# EAGLE design blue_lora_v2 (EAGLE 9.1.3)
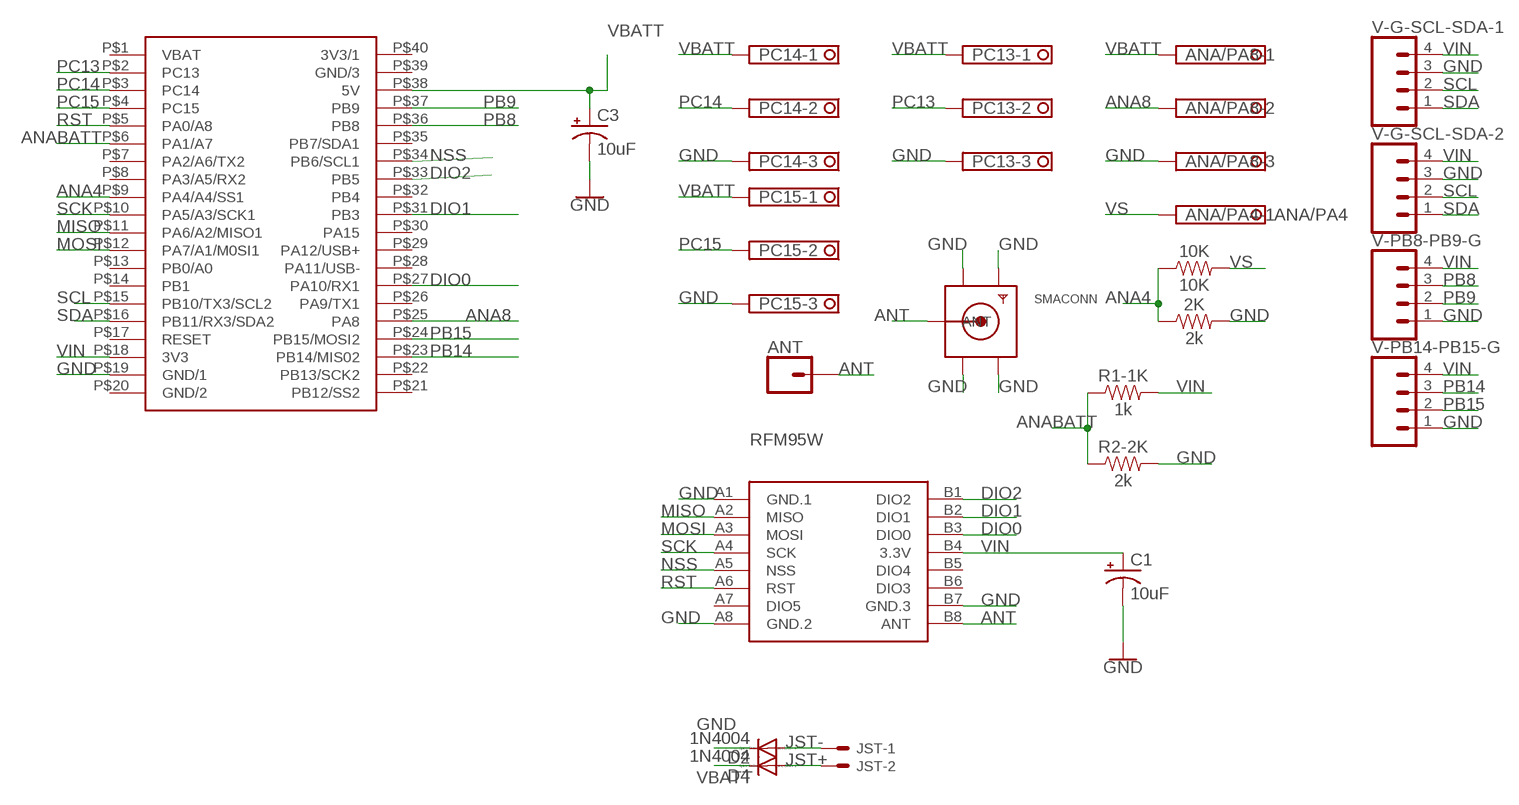
[diagram p0: schematic, sheet 1]

## Parts
2K  2k  1KOHM-HORIZ_KIT-1/4W-1%  [AXIAL-0.3-KIT]
10K  10K  1KOHM-HORIZ_KIT-1/4W-1%  [AXIAL-0.3-KIT]
ANA/PA4  ANA/PA4  TERMINAL-BLOCK-3.5MM-2-PIN-LONG-PAD  [TERMINAL-BLOCK-2-PIN-3.5MM-LONG-PAD]
ANA/PA8  TERMINAL-BLOCK-3.5MM-3-PIN-LONG-PAD  [TERMINAL-BLOCK-3-PIN-3.5MM-LONG-PAD]
ANT  CONN_01  [1X01]
C1  10uF  10UF-POLAR-RADIAL-2.5MM-25V-20%  [CPOL-RADIAL-2.5MM-5MM]
C3  10uF  10UF-POLAR-RADIAL-2.5MM-25V-20%  [CPOL-RADIAL-2.5MM-5MM]
D2  1N4004  [DO41-10]
D4  1N4004  [DO41-10]
JST  JST-XH-02-PIN-LONG-PAD  [JST-XH-02-PACKAGE-LONG-PAD]
PC13  TERMINAL-BLOCK-3.5MM-3-PIN-LONG-PAD  [TERMINAL-BLOCK-3-PIN-3.5MM-LONG-PAD]
PC14  TERMINAL-BLOCK-3.5MM-3-PIN-LONG-PAD  [TERMINAL-BLOCK-3-PIN-3.5MM-LONG-PAD]
PC15  TERMINAL-BLOCK-3.5MM-3-PIN-LONG-PAD  [TERMINAL-BLOCK-3-PIN-3.5MM-LONG-PAD]
R1-1K  1k  1KOHM-HORIZ_KIT-1/4W-1%  [AXIAL-0.3-KIT]
R2-2K  2k  1KOHM-HORIZ_KIT-1/4W-1%  [AXIAL-0.3-KIT]
RFM95W  WIRELESS-LORA-RFM95W#SMD  [WIRELESS-LORA-RFM95W#SMD]
SMACONN  SMACONNECTOR_EDGE  [SMA_EDGELAUNCH]
U$2  BLUEPILL  [BLUEPILL]
V-G-SCL-SDA-1  CONN_04LOCK_LONGPADS  [1X04_LOCK_LONGPADS]
V-G-SCL-SDA-2  CONN_04LOCK_LONGPADS  [1X04_LOCK_LONGPADS]
V-PB8-PB9-G  CONN_04LOCK_LONGPADS  [1X04_LOCK_LONGPADS]
V-PB14-PB15-G  CONN_04LOCK_LONGPADS  [1X04_LOCK_LONGPADS]

## Nets
ANA4: 2K.P$1 10K.P$1 U$2.P$9(PA4/A4/SS1)
ANA8: ANA/PA8.2 U$2.P$25(PA8)
ANABATT: R1-1K.P$1 R2-2K.P$1 U$2.P$6(PA1/A7)
ANT: ANT.1 RFM95W.B8(ANT) SMACONN.P(ANT)
DIO0: RFM95W.B3(DIO0) U$2.P$27(PA10/RX1)
DIO1: RFM95W.B2(DIO1) U$2.P$31(PB3)
DIO2: RFM95W.B1(DIO2) U$2.P$33(PB5)
GND: 2K.P$2 ANA/PA8.3 C1.2(-) C3.2(-) D2.C PC13.3 PC14.3 PC15.3 R2-2K.P$2 RFM95W.A1(GND.1) RFM95W.A8(GND.2) RFM95W.B7(GND.3) SMACONN.GND@1(GND4) SMACONN.GND@2(GND3) SMACONN.GND@3(GND2) SMACONN.GND@4(GND1) U$2.P$19(GND/1) V-G-SCL-SDA-1.3 V-G-SCL-SDA-2.3 V-PB8-PB9-G.1 V-PB14-PB15-G.1
JST+: D4.A JST.2
JST-: D2.A JST.1
MISO: RFM95W.A2(MISO) U$2.P$11(PA6/A2/MISO1)
MOSI: RFM95W.A3(MOSI) U$2.P$12(PA7/A1/M0SI1)
NSS: RFM95W.A5(NSS) U$2.P$34(PB6/SCL1)
PB8: U$2.P$36(PB8) V-PB8-PB9-G.3
PB9: U$2.P$37(PB9) V-PB8-PB9-G.2
PB14: U$2.P$23(PB14/MIS02) V-PB14-PB15-G.3
PB15: U$2.P$24(PB15/MOSI2) V-PB14-PB15-G.2
PC13: PC13.2 U$2.P$2(PC13)
PC14: PC14.2 U$2.P$3(PC14)
PC15: PC15.2 U$2.P$4(PC15)
RST: RFM95W.A6(RST) U$2.P$5(PA0/A8)
SCK: RFM95W.A4(SCK) U$2.P$10(PA5/A3/SCK1)
SCL: U$2.P$15(PB10/TX3/SCL2) V-G-SCL-SDA-1.2 V-G-SCL-SDA-2.2
SDA: U$2.P$16(PB11/RX3/SDA2) V-G-SCL-SDA-1.1 V-G-SCL-SDA-2.1
VBATT: ANA/PA8.1 C3.1(+) D4.C PC13.1 PC14.1 PC15.1 U$2.P$38(5V)
VIN: C1.1(+) R1-1K.P$2 RFM95W.B4(3.3V) U$2.P$18(3V3) V-G-SCL-SDA-1.4 V-G-SCL-SDA-2.4 V-PB8-PB9-G.4 V-PB14-PB15-G.4
VS: 10K.P$2 ANA/PA4.1
Unconnected: ANA/PA4.2 RFM95W.A7(DIO5) RFM95W.B5(DIO4) RFM95W.B6(DIO3) U$2.P$1(VBAT) U$2.P$7(PA2/A6/TX2) U$2.P$8(PA3/A5/RX2) U$2.P$13(PB0/A0) U$2.P$14(PB1) U$2.P$17(RESET) U$2.P$20(GND/2) U$2.P$21(PB12/SS2) U$2.P$22(PB13/SCK2) U$2.P$26(PA9/TX1) U$2.P$28(PA11/USB-) U$2.P$29(PA12/USB+) U$2.P$30(PA15) U$2.P$32(PB4) U$2.P$35(PB7/SDA1) U$2.P$39(GND/3) U$2.P$40(3V3/1)

## Library data of the parts
2K 10K R2-2K = SparkFun-Resistors:1KOHM: 1kΩ resistor A resistor is a passive two-terminal electrical component that implements electrical resistance as a circuit element. Resistors act to reduce current flow, and, at the same time, act to lower voltage levels within circuits. - Wikipedia; PROD_ID: RES-12182; VALUE: 1k
ANA/PA4 = Rembrandt Electronics - Terminal Block 3-5mm v1-0:TERMINAL-BLOCK-3.5MM-2-PIN: Terminal Block 3.5mm Pitch: 3,5 mm Number of pins: 2 Created by Rembrandt Electronics www.rembrandtelectronics.com
ANA/PA8 PC13-PC15 = Rembrandt Electronics - Terminal Block 3-5mm v1-0:TERMINAL-BLOCK-3.5MM-3-PIN: Terminal Block 3.5mm Pitch: 3,5 mm Number of pins: 3 Created by Rembrandt Electronics www.rembrandtelectronics.com
ANT = SparkFun-Connectors:CONN_01: Single connection point. Often used as Generic Header-pin footprint for 0.1 inch spaced/style header connections On any of the 0.1 inch spaced packages, you can populate with these: Break Away Headers - Straight <https://www.sparkfun.com/products/116> (PRT-00116) Break Away Male Headers - Right Angle <https://www.sparkfun.com/products/553> (PRT-00553) Female Headers <https://www.sparkfun.com/products/115> (PRT-00115) Break Away Headers - Machine Pin <https://www.sparkfun.com/products/117> (PRT-00117) Break Away Female Headers - Swiss Machine Pin <https://www.sparkfun.com/products/743> (PRT-00743) This device is also useful as a general connection point to wire up your design to another part of your project. Our various solder wires solder well into these plated through hole pads. Hook-Up Wire - Assortment (Stranded, 22 AWG) <https://www.sparkfun.com/products/11375> (PRT-11375) Hook-Up Wire - Assortment (Solid Core, 22 AWG) <https://www.sparkfun.com/products/11367> (PRT-11367) View the entire wire category on our website here <https://www.sparkfun.com/categories/141> Special notes: SMTSO-256-ET is a "flush mount" nut for a 4-40 screw. We mostly use this on specialty testbeds; it is a nice way to connect hardware to your PCB at an adjustable hieght. Also note, the SNAP packages are for using a snappable style connector. We sell a baggie of snaps and they are also used on two LilyPad designs: Snap Assortment - 30 pack (male and female) <https://www.sparkfun.com/products/11347> (DEV-11347) LilyPad Arduino SimpleSnap <https://www.sparkfun.com/products/10941> (DEV-10941) LilyPad SimpleSnap Protoboard <https://www.sparkfun.com/products/10940> (DEV-10940)
C1 C3 = SparkFun-Capacitors:10UF-POLAR: 10.0µF polarized capacitors A capacitor is a passive two-terminal electrical component used to store electrical energy temporarily in an electric field.; PROD_ID: CAP-08440
D2 D4 = diode:1N4004: DIODE general purpose rectifier, 1 A
JST = Rembrandt Electronics - JST XH Connectors v1-0:JST-XH-02-PIN: JST XH Connector 2 Pin Wire to board connector. Pitch: 2,54 mm, (0.100") Number of pins: 2 Created by Rembrandt Electronics www.rembrandtelectronics.com
R1-1K = SparkFun-Resistors:1KOHM: 1kΩ resistor A resistor is a passive two-terminal electrical component that implements electrical resistance as a circuit element. Resistors act to reduce current flow, and, at the same time, act to lower voltage levels within circuits. - Wikipedia; PROD_ID: RES-12182
RFM95W = diy-modules:WIRELESS-LORA-RFM95W: 868/915 MHz LoRa Radio Transceiver Module based on SX1276 chip Click here to find device on ebay.com <http://www.ebay.com/sch/RFM95W+transceiver>
SMACONN = adafruit:SMACONNECTOR: SMA Connector 90° DIP SMA Connector, 50 Ohm (4UConnector: 07259)
U$2 = stm32duino boards:BLUEPILL
V-G-SCL-SDA-1 V-G-SCL-SDA-2 V-PB8-PB9-G V-PB14-PB15-G = SparkFun-Connectors:CONN_04: Multi connection point. Often used as Generic Header-pin footprint for 0.1 inch spaced/style header connections On any of the 0.1 inch spaced packages, you can populate with these: Break Away Headers - Straight <https://www.sparkfun.com/products/116> (PRT-00116) Break Away Male Headers - Right Angle <https://www.sparkfun.com/products/553> (PRT-00553) Female Headers <https://www.sparkfun.com/products/115> (PRT-00115) Break Away Headers - Machine Pin <https://www.sparkfun.com/products/117> (PRT-00117) Break Away Female Headers - Swiss Machine Pin <https://www.sparkfun.com/products/743> (PRT-00743) For SCREWTERMINALS and SPRING TERMINALS visit here: Screw Terimnals on SparkFun.com <https://www.sparkfun.com/search/results?term=Screw+Terminals> (5mm/3.5mm/2.54mm spacing) This device is also useful as a general connection point to wire up your design to another part of your project. Our various solder wires solder well into these plated through hole pads. Hook-Up Wire - Assortment (Stranded, 22 AWG) <https://www.sparkfun.com/products/11375> (PRT-11375) Hook-Up Wire - Assortment (Solid Core, 22 AWG) <https://www.sparkfun.com/products/11367> (PRT-11367) View the entire wire category on our website here <https://www.sparkfun.com/categories/141> Special notes: Molex polarized connector foot print use with SKU : PRT-08231 with associated crimp pins and housings. 1MM SMD Version SKU: PRT-10208; PROD_ID: CONN-09696

## Board
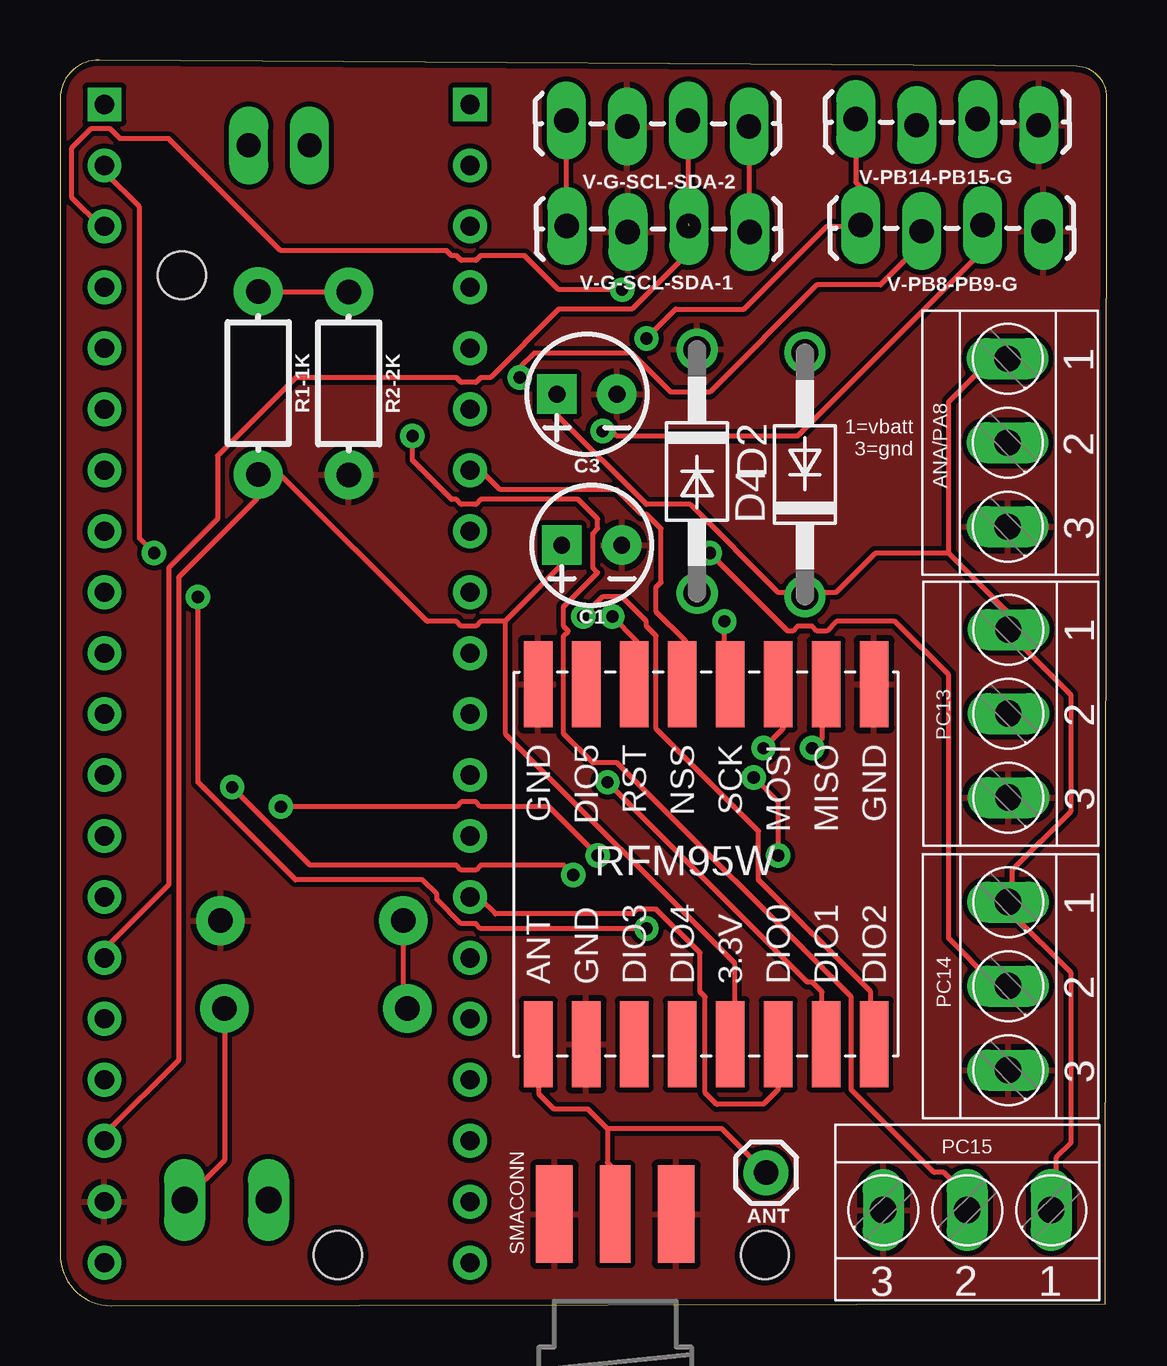
[diagram p1: board, top side]
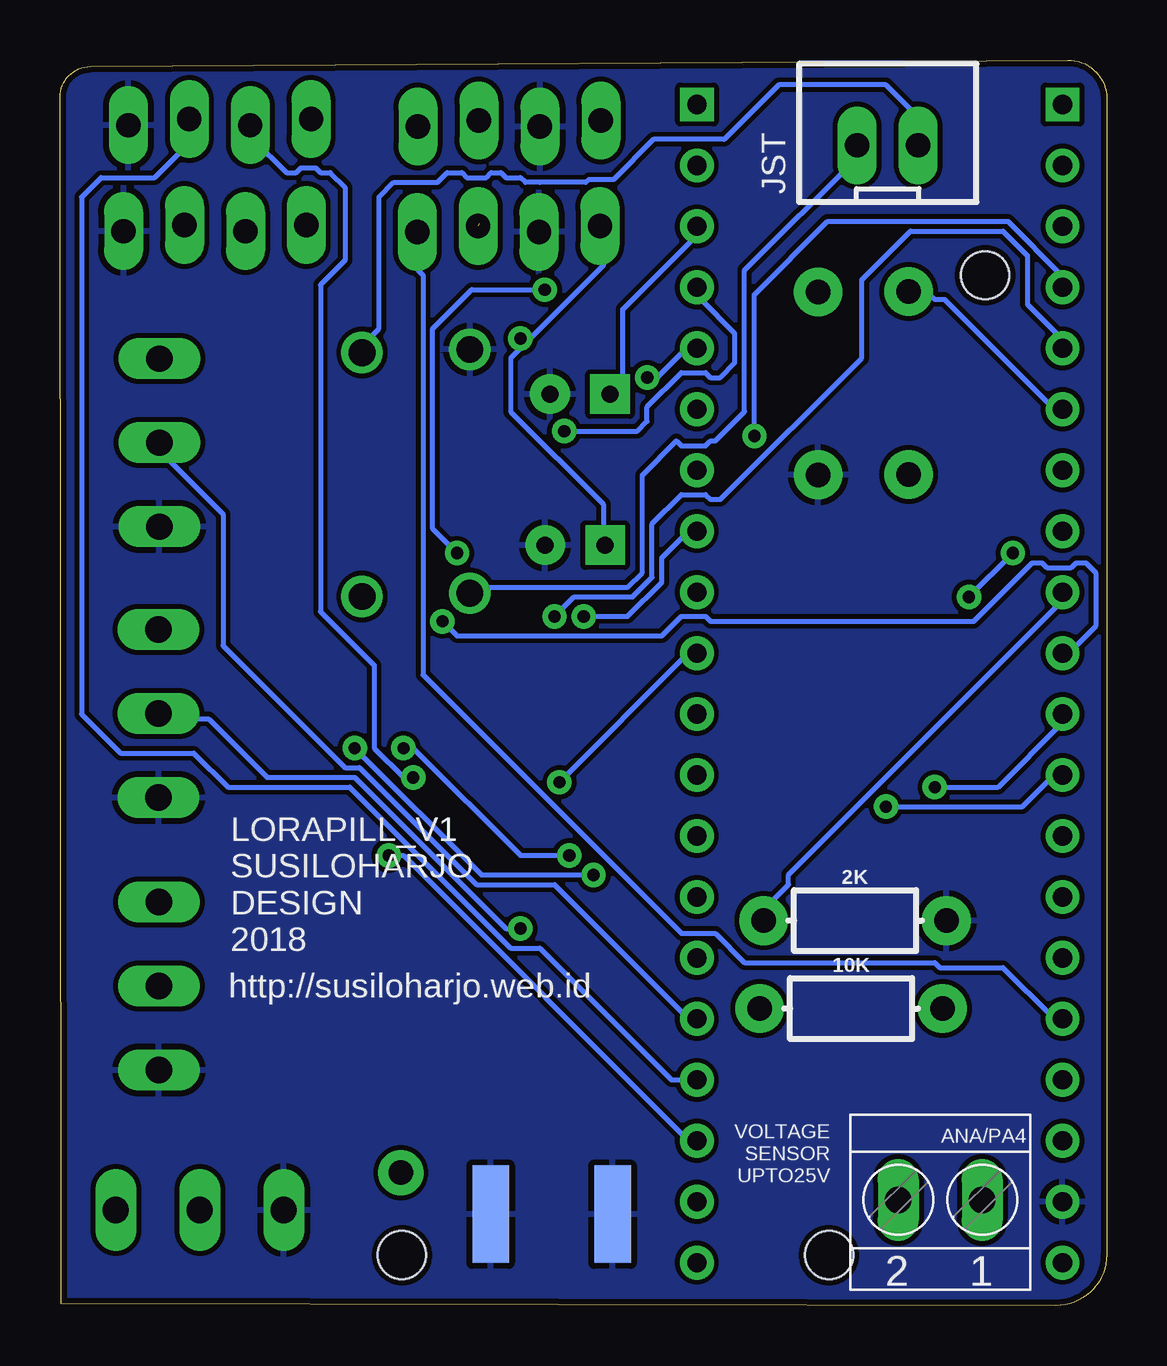
[diagram p2: board, bottom side, seen from below]

Size 43.64 x 51.9 mm. Coordinates in mm from the lower left corner, seen from the top.
Outline: 0,50.28 0.01,2.12 arc90 2.13,0 43.58,0.08 43.64,50.34 arc90 42.37,51.63 1.64,51.9 arc90 0,50.28
Copper layers (1*16): Top 0.035mm / dielectric 1.5mm / Bottom 0.035mm
Design rules "SparkFun": minimum track width 8mil, minimum drill 20mil, track to track 8mil, track to pad 8mil, pad to pad 8mil, via to via 8mil, smd to smd 8mil, copper to edge 10mil, drill to drill 8mil, minimum pad ring 12mil, minimum via ring 10mil, stop-mask expansion 4mil, vias tented up to drill 25mil, thermal gap 10mil
Holes 2 mm at 5.08,42.93 11.58,2.1 29.38,2.1

### Footprints (pad centres in the part's own frame; a part is rotated, then mirrored left to right if it is on the bottom)
AXIAL-0.3-KIT = drill 1.016 pad 2.032: P$1 -3.81,0; P$2 3.81,0
TERMINAL-BLOCK-2-PIN-3.5MM-LONG-PAD = drill 1.1 pad 1.7 long: 1 -1.75,-0.1; 2 1.75,-0.1
TERMINAL-BLOCK-3-PIN-3.5MM-LONG-PAD = drill 1.1 pad 1.7 long: 1 -3.5,-0.1; 2 0,-0.1; 3 3.5,-0.1
1X01 = drill 1.016 pad 1.88: 1 0,0
CPOL-RADIAL-2.5MM-5MM = drill 0.7 pad 1.651 square: 1 1.25,0 | drill 0.7 pad 1.651: 2 -1.25,0
DO41-10 = drill 1.118: A 5.08,0; C -5.08,0
JST-XH-02-PACKAGE-LONG-PAD = drill 1.016 long: 1 -1.27,0; 2 1.27,0
WIRELESS-LORA-RFM95W#SMD = smd 3.6 x 1.2: A1 -7.5,7; A2 -7.5,5; A3 -7.5,3; A4 -7.5,1; A5 -7.5,-1; A6 -7.5,-3; A7 -7.5,-5; A8 -7.5,-7; B1 7.5,7; B2 7.5,5; B3 7.5,3; B4 7.5,1; B5 7.5,-1; B6 7.5,-3; B7 7.5,-5; B8 7.5,-7
SMA_EDGELAUNCH = smd 4.064 x 1.524: GND@1 2.032,-2.54; GND@2 2.032,2.54 | smd 4.064 x 1.524 bottom: GND@3 2.032,2.54; GND@4 2.032,-2.54 | smd 4.064 x 1.27: P 2.032,0
BLUEPILL = drill 0.8 square: P$1 -7.62,22.86; P$40 7.62,22.86 | drill 0.8: P$2 -7.62,20.32; P$3 -7.62,17.78; P$4 -7.62,15.24; P$5 -7.62,12.7; P$6 -7.62,10.16; P$7 -7.62,7.62; P$8 -7.62,5.08; P$9 -7.62,2.54; P$10 -7.62,0; P$11 -7.62,-2.54; P$12 -7.62,-5.08; P$13 -7.62,-7.62; P$14 -7.62,-10.16; P$15 -7.62,-12.7; P$16 -7.62,-15.24; P$17 -7.62,-17.78; P$18 -7.62,-20.32; P$19 -7.62,-22.86; P$20 -7.62,-25.4; P$21 7.62,-25.4; P$22 7.62,-22.86; P$23 7.62,-20.32; P$24 7.62,-17.78; P$25 7.62,-15.24; P$26 7.62,-12.7; P$27 7.62,-10.16; P$28 7.62,-7.62; P$29 7.62,-5.08; P$30 7.62,-2.54; P$31 7.62,0; P$32 7.62,2.54; P$33 7.62,5.08; P$34 7.62,7.62; P$35 7.62,10.16; P$36 7.62,12.7; P$37 7.62,15.24; P$38 7.62,17.78; P$39 7.62,20.32
1X04_LOCK_LONGPADS = drill 1.016 long: 1 0,0; 2 2.54,-0.254; 3 5.08,0; 4 7.62,-0.254

### Placement (x,y rotation side)
2K  10.5,16.04 0 bottom
10K  10.66,12.37 0 bottom
ANA/PA4  6.95,4.3 180 bottom
ANA/PA8  39.6,35.95 270 top
ANT  29.43,5.54 0 top
C1  22.17,31.69 180 top
C3  21.97,37.97 180 top
D2  26.56,34.76 270 top
D4  31.05,34.63 90 top
JST  9.14,48.34 0 bottom
PC13  39.63,24.67 270 top
PC14  39.62,13.31 270 top
PC15  37.82,3.88 180 top
R1-1K  8.26,38.44 270 top
R2-2K  12.04,38.42 270 top
RFM95W  26.94,18.39 270 top
SMACONN  23.15,1.78 90 top
U$2  9.47,27.19 0 top
V-G-SCL-SDA-1  28.75,44.73 180 top
V-G-SCL-SDA-2  28.72,49.12 180 top
V-PB8-PB9-G  40.99,44.77 180 top
V-PB14-PB15-G  40.79,49.18 180 top

### Tracks (layer width: path | path; a pad name or v marks a point on that pad's centre or on a via)
ANA4
  Top 0.203: 2K.P$1 14.31,12.54 10K.P$1
  Bottom 0.203: U$2.P$9 1.89,29.53 1.89,29.32 13.27,17.94 13.27,17.54 14.29,16.52 14.29,16.11 2K.P$1
ANA8
  Bottom 0.203: U$2.P$25 17.13,12.05 17.54,12.05 23.03,17.54 26.28,17.54 31.15,22.41 31.76,22.41 36.84,27.49 36.84,32.98 39.69,35.82 ANA/PA8.2
ANABATT
  Top 0.203: R1-1K.P$1 12.02,42.25 R2-2K.P$1
  Bottom 0.203: U$2.P$6 1.89,37.45 2.3,37.45 6.77,41.92 7.18,41.92 7.38,42.12 8.19,42.12 R1-1K.P$1
ANT
  Top 0.203: 22.82,7.38 22.01,8.19 20.59,8.19 19.98,8.8 19.98,10.83 RFM95W.B8 | SMACONN.P 23.03,3.92 23.03,5.75 22.82,5.95 22.82,7.38 | ANT.1 27.59,7.38 22.82,7.38
DIO0
  Top 0.203: U$2.P$27 17.13,16.93 17.54,16.93 18.15,16.32 23.84,16.32 24.04,16.52 24.85,16.52 26.68,14.69 26.68,13.07 26.89,12.86 26.89,8.87 27.39,8.37 27.41,8.39 29.32,8.39 29.93,9 29.93,10.83 RFM95W.B3
DIO1  (via drill 0.51)
  Top 0.203: v22.82,21.8 31.15,13.47 31.36,13.47 31.76,13.07 31.76,11.03 RFM95W.B2
  Bottom 0.203: v22.82,21.8 17.54,27.09 17.13,27.09 U$2.P$31
DIO2  (via drill 0.51)
  Top 0.203: v21.81,28.71 22.62,29.53 23.43,29.53 24.45,28.51 24.45,28.31 24.85,27.9 24.85,24.04 29.12,19.77 29.12,17.74 33.79,13.07 33.79,11.03 RFM95W.B1
  Bottom 0.203: v21.81,28.71 19.98,28.71 18.55,30.13 18.55,31.15 17.54,32.17 17.13,32.17 U$2.P$33
GND
  pour Top: 1.39,51.87 arc90 1.41,51.86 42.7,51.86 arc-90 43.62,50.94 43.62,0.07 arc-90 43.52,-0.02 2.03,-0.02 arc-90 0,2 0,2.87 arc-90 -0.04,2.92 -0.04,50.48 arc-90 1.36,51.88 1.4,51.88
  pour Bottom: 42.46,51.71 arc-90 43.62,50.55 43.62,49.06 arc90 43.47,48.91 43.47,0.03 arc90 43.46,0.04 2.12,0.04 arc-90 -0.03,2.19 -0.03,2.25 arc90 0.02,2.29 0.02,50.34 arc-90 1.39,51.72
JST+
  Bottom 0.203: JST.2 7.99,48.42 7.99,49.64 9.21,50.86 13.68,50.86 15.95,48.59 18.9,48.59 20.56,46.92 21.6,46.92 21.72,46.8 23.63,46.8 24.24,46.8 24.45,47 25.06,47 25.26,47.2 25.67,47.2 25.87,47 26.68,47 26.89,47.2 27.5,47.2 27.9,46.8 29.73,46.8 30.34,46.19 30.34,40.7 31.15,39.89 D4.A
JST-
  Bottom 0.203: JST.1 10.43,48.22 10.43,47.81 15.1,43.14 15.1,37.25 16.32,36.03 16.52,36.03 16.73,35.82 17.74,35.82 17.95,36.03 19.37,34.61 19.37,30.54 19.98,29.93 26.28,29.93 26.48,29.73 D2.A
MISO  (via drill 0.51)
  Top 0.203: v7.18,21.6 10.43,18.35 16.52,18.35 16.73,18.15 17.34,18.15 17.54,18.35 20.99,18.35 v21.4,17.94 | v31.36,23.23 31.76,23.63 31.76,25.87 RFM95W.A2
  Bottom 0.203: v7.18,21.6 4.53,21.6 1.89,24.24 1.89,24.45 U$2.P$11 | v21.4,17.94 26.07,17.94 v31.36,23.23
MOSI  (via drill 0.51)
  Top 0.203: v9.21,20.79 16.52,20.79 16.73,20.99 17.34,20.99 17.54,20.79 20.38,20.79 v22.42,18.76 | v29.32,23.23 30.14,24.04 30.14,25.87 RFM95W.A3
  Bottom 0.203: v9.21,20.79 3.52,20.79 2.3,22.01 1.89,22.01 U$2.P$12 | v22.42,18.76 24.45,18.76 28.92,23.23 v29.32,23.23
NSS
  Top 0.203: U$2.P$34 17.13,34.61 17.74,34.61 18.35,34 23.23,34 24.24,32.98 24.45,32.98 25.06,32.37 25.06,30.13 24.85,29.93 24.85,28.92 26.07,27.7 26.07,26.07 RFM95W.A5
PB8  (via drill 0.51)
  Top 0.203: v19.16,38.67 19.16,39.08 19.77,39.69 23.84,39.69 25.46,38.06 27.09,38.06 31.56,42.53 34.2,42.53 35.83,44.16 35.83,44.56 V-PB8-PB9-G.3
  Bottom 0.203: v19.16,38.67 18.76,38.67 17.74,39.69 17.13,39.69 U$2.P$36
PB9  (via drill 0.51)
  Top 0.203: v22.62,36.43 23.03,36.43 23.23,36.23 30.75,36.23 38.27,43.75 38.27,44.97 V-PB8-PB9-G.2
  Bottom 0.203: v22.62,36.43 19.57,36.43 19.16,36.84 19.16,37.45 17.74,38.87 16.73,38.87 16.52,38.67 16.12,38.67 15.51,39.28 15.51,40.5 16.93,41.92 16.93,42.33 U$2.P$37
PB14  (via drill 0.51)
  Top 0.203: v29.93,18.76 29.93,20.99 v28.92,22.01
  Bottom 0.203: v29.93,18.76 29.32,18.76 17.54,6.97 17.13,6.97 U$2.P$23 | v28.92,22.01 29.32,22.01 30.54,23.23 30.54,26.68 32.78,28.92 32.78,42.53 31.76,43.55 31.76,46.59 32.37,47.2 32.78,47.2 32.98,47.41 33.59,47.41 33.79,47.2 34.2,47.2 35.62,48.63 35.62,49.03 V-PB14-PB15-G.3
PB15
  Bottom 0.203: U$2.P$24 17.13,9.41 18.15,9.41 23.63,14.89 24.85,14.89 31.56,21.6 36.64,21.6 38.06,23.02 41.11,23.02 42.74,24.65 42.74,46.19 41.92,47 39.69,47 38.27,48.42 38.27,49.24 V-PB14-PB15-G.2
PC13  (via drill 0.51)
  Top 0.203: v3.92,31.35 3.31,31.96 3.31,45.78 1.89,47.2 1.89,47.41 U$2.P$2 | v5.75,29.53 5.75,21.8 9.82,17.74 15.1,17.74 15.71,17.13 15.71,16.93 16.73,15.91 17.34,15.91 17.54,15.71 v24.45,15.71
  Bottom 0.203: v5.75,29.53 v3.92,31.35 | v24.45,15.71 25.06,15.71 31.36,22.01 35.01,22.01 37.45,24.45 39.28,24.45 39.48,24.65 PC13.2
PC14  (via drill 0.51)
  Top 0.203: v23.43,42.33 20.79,42.33 19.37,43.75 17.54,43.75 17.34,43.55 16.73,43.55 16.52,43.75 16.32,43.75 16.12,43.95 9.21,43.95 4.53,48.63 2.5,48.63 2.1,49.03 1.28,49.03 0.47,48.22 0.47,46.19 1.69,44.97 U$2.P$3 | v27.09,31.35 30.34,28.1 30.54,28.1 30.75,28.31 31.36,28.31 31.56,28.1 31.97,28.1 32.37,28.51 34.81,28.51 37.05,26.27 37.05,15.3 38.87,13.47 39.48,13.47 PC14.2
  Bottom 0.203: v23.43,42.33 26.48,42.33 28.11,40.7 28.11,32.37 v27.09,31.35
PC15  (via drill 0.51)
  Top 0.203: v14.69,36.23 14.69,35.21 16.32,33.59 16.52,33.59 16.73,33.39 17.34,33.39 17.54,33.59 21.6,33.59 22.42,32.78 22.42,32.37 22.21,32.17 22.21,30.74 22.42,30.54 20.99,29.12 20.99,28.31 21.2,28.1 20.99,27.9 20.99,23.84 22.21,22.62 23.23,22.62 32.98,12.86 32.98,9 36.44,5.55 36.84,5.55 37.66,4.73 37.66,4.13 PC15.2
  Bottom 0.203: v14.69,36.23 14.69,42.12 11.65,45.17 4.13,45.17 1.89,42.94 1.89,42.53 U$2.P$4
RST  (via drill 0.51)
  Top 0.203: v23.03,28.71 24.04,27.7 24.04,26.07 RFM95W.A6
  Bottom 0.203: v23.03,28.71 22.21,29.53 19.77,29.53 18.96,30.34 18.96,32.57 17.74,33.79 16.73,33.79 16.52,33.59 16.12,33.59 10.22,39.48 10.22,42.73 8.19,44.77 4.33,44.77 3.31,43.75 3.31,41.72 1.89,40.29 1.89,39.89 U$2.P$5
SCK  (via drill 0.51)
  Top 0.203: v27.7,28.51 27.7,26.27 27.9,26.07 RFM95W.A4
  Bottom 0.203: v27.7,28.51 27.09,27.9 18.55,27.9 17.74,28.71 16.73,28.71 16.52,28.51 5.55,28.51 3.11,30.95 2.71,30.95 2.5,30.74 1.49,30.74 1.28,30.95 0.88,30.95 0.47,30.54 0.47,28.31 1.49,27.29 1.69,27.29 U$2.P$10
SCL  (1 unrouted)
  Top 0.203: U$2.P$15 1.89,14.49 1.89,14.89 4.53,17.54 4.53,30.74 6.57,32.78 6.57,35.42 9.82,38.67 16.52,38.67 16.73,38.47 17.34,38.47 17.54,38.67 17.95,38.67 20.79,41.51 23.84,41.51 26.07,43.75 26.07,44.97 26.18,45.07 V-G-SCL-SDA-2.2
SDA
  Top 0.203: V-G-SCL-SDA-2.1 28.72,44.77 V-G-SCL-SDA-1.1
  Bottom 0.203: U$2.P$16 1.89,12.05 2.3,12.05 4.33,14.08 6.97,14.08 7.18,14.29 15.1,14.29 16.32,15.5 17.74,15.5 28.51,26.27 28.51,42.94 28.71,43.14 28.71,44.56 V-G-SCL-SDA-1.1
VBATT
  Top 0.203: 37.05,31.35 37.05,37.65 38.67,39.28 39.48,39.28 ANA/PA8.1 | 37.05,31.35 39.48,28.92 39.48,28.31 PC13.1 39.48,28.1 42.13,25.46 42.13,20.58 39.69,18.15 39.69,16.93 PC14.1 39.69,16.72 39.69,16.32 42.13,13.88 42.13,6.77 41.52,6.16 41.52,4.13 PC15.1 | 37.05,31.35 34,31.35 32.37,29.73 31.15,29.73 D4.C 30.95,29.73 29.93,29.73 26.28,33.39 24.45,33.39 20.79,37.04 20.79,37.86 C3.1
  Bottom 0.203: U$2.P$38 17.13,44.77 17.13,44.56 20.18,41.51 20.18,38.47 20.59,38.06 C3.1
VIN  (via drill 0.51)
  Top 0.203: U$2.P$18 1.89,6.97 1.89,7.17 4.94,10.22 4.94,30.34 8.19,33.59 8.19,34.61 R1-1K.P$2 8.39,34.61 9.21,34.61 15.3,28.51 16.52,28.51 16.73,28.31 17.34,28.31 17.54,28.51 18.55,28.51 | 18.55,28.51 18.55,23.84 28.11,14.29 28.11,11.03 RFM95W.B4 | 18.55,28.51 20.99,30.95 20.99,31.56 C1.1 | v24.45,40.29 25.67,41.51 28.51,41.51 31.97,44.97 33.19,44.97 V-PB8-PB9-G.4 33.39,45.17 33.39,46.59 33.17,46.81 V-PB14-PB15-G.4 | V-G-SCL-SDA-2.4 21.1,45.02 V-G-SCL-SDA-1.4
  Bottom 0.203: 24.24,40.09 20.99,43.34 20.99,44.97 V-G-SCL-SDA-1.4 | 24.24,40.09 24.85,39.48 24.85,37.25 20.99,33.39 20.99,31.76 C1.1 | 24.24,40.09 v24.45,40.29
VS
  Top 0.203: 10K.P$2 6.86,6.06 ANA/PA4.1

### Text on the board
tPlace: 1=vbatt / 3=gnd
bNames: LORAPILL_V1 / SUSILOHARJO / DESIGN / 2018 | http://susiloharjo.web.id | VOLTAGE / SENSOR / UPTO25V